# EAGLE design feuchte (EAGLE 6.6.0)
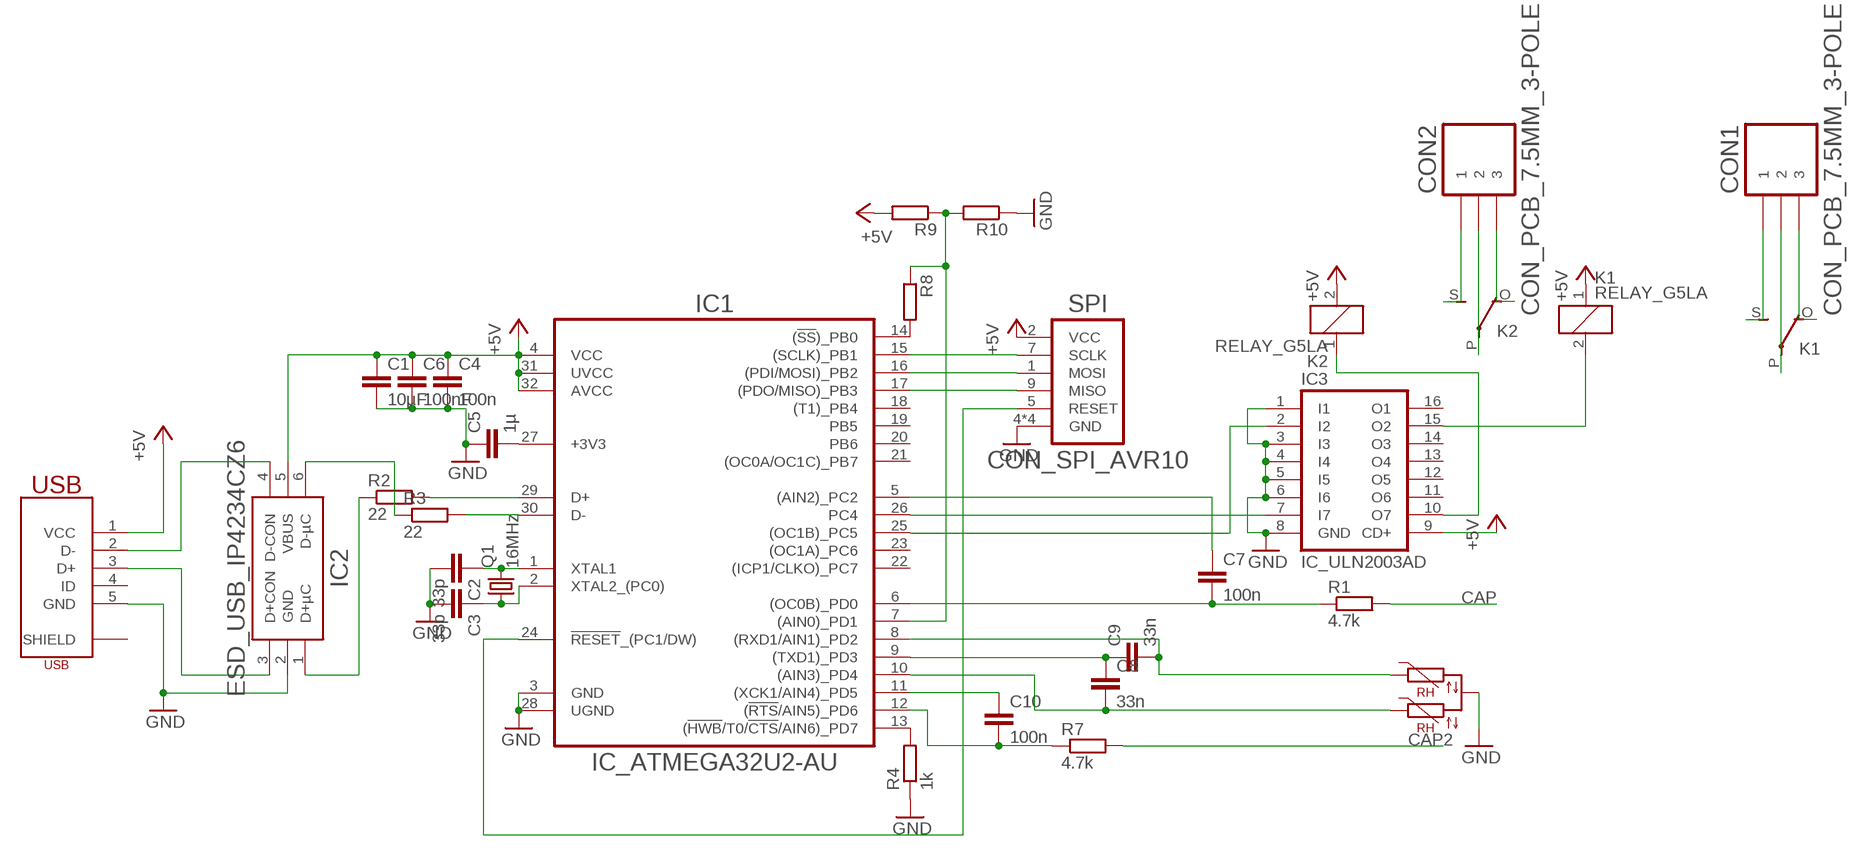
[diagram p0: schematic, sheet 1]

## Parts
C1  10µF  C  [0603]
C2  33p  C  [0603]
C3  33p  C  [0603]
C4  100n  C  [0603]
C5  1µ  C  [0603]
C6  100nF  C  [0603]
C7  100n  C  [0603]
C8  33n  C  [0603]
C9  33n  C  [0603]
C10  100n  C  [0603]
CON1  CON_PCB_7.5MM_3-POLE  [CON_PCB_7.5MM_3-POLE]
CON2  CON_PCB_7.5MM_3-POLE  [CON_PCB_7.5MM_3-POLE]
IC1  IC_ATMEGA32U2-AU  [IC_ATMEGA32U2-AU]
IC2  ESD_USB_IP4234CZ6  [ESD_USB_IP4234CZ6]
IC3  IC_ULN2003AD  [SOIC16]
K1  RELAY_G5LA  [RELAY_G5LA]
K2  RELAY_G5LA  [RELAY_G5LA]
Q1  16MHz  QUARTZ_HC49S  [QUARTZ_HC49S]
R1  4.7k  RSMD  [0603]
R2  22  RSMD  [0603]
R3  22  RSMD  [0603]
R4  1k  RSMD  [0603]
R7  4.7k  RSMD  [0603]
R8  RTHT_10MM  [R_THT_10MM]
R9  RTHT_7.5MM  [R_THT_7.5MM]
R10  RTHT_7.5MM  [R_THT_7.5MM]
SPI  CON_SPI_AVR10  [CON_ISP_AVR10]
U$2  SENS_SHS-A5  [SENS_SHS-A5]
USB  CON_MICROUSB_ZX62R-B-5P  [CON_MICROUSB_ZX62R-B-5P]

## Nets
+3V3: C5.2 IC1.27(+3V3)
+5V: C1.1 C4.1 C6.1 IC1.4(VCC) IC1.31(UVCC) IC1.32(AVCC) IC2.5(VBUS) IC3.9(CD+) K1.1 K2.2 R9.2 SPI.2(VCC) USB.1(VCC)
CAP: R1.2
CAP2: R7.2
GND: C1.2 C2.2 C3.2 C4.2 C5.1 C6.2 IC1.3(GND) IC1.28(UGND) IC2.2(GND) IC3.1(I1) IC3.3(I3) IC3.4(I4) IC3.5(I5) IC3.6(I6) IC3.8(GND) R4.1 R10.1 SPI.4(GND) SPI.6(GND) SPI.8(GND) SPI.10(GND) U$2.1 USB.5(GND)
N$1: C2.1 IC1.1(XTAL1) Q1.2
N$2: C3.1 IC1.2(XTAL2_(PC0)) Q1.1
N$3: IC1.15((SCLK)_PB1) SPI.7(SCLK)
N$4: IC1.16((PDI/MOSI)_PB2) SPI.1(MOSI)
N$5: IC1.17((PDO/MISO)_PB3) SPI.9(MISO)
N$6: IC1.24(!RESET!_(PC1/DW)) SPI.5(RESET)
N$7: CON2.2 K2.P
N$8: C7.1 IC1.5((AIN2)_PC2)
N$9: C7.2 IC1.6((OC0B)_PD0) R1.1
N$10: C10.1 IC1.11((XCK1/AIN4)_PD5)
N$11: IC1.26(PC4) IC3.7(I7)
N$12: IC1.25((OC1B)_PC5) IC3.2(I2)
N$13: IC3.10(O7) K2.1
N$14: IC3.15(O2) K1.2
N$15: CON2.1 K2.S
N$16: CON2.3 K2.O
N$17: CON1.1 K1.S
N$18: CON1.2 K1.P
N$19: CON1.3 K1.O
N$20: IC1.13((!HWB!/T0/!CTS!/AIN6)_PD7) R4.2
N$22: C9.2 IC1.8((RXD1/AIN1)_PD2) U$2.3
N$24: C8.1 C9.1 IC1.9((TXD1)_PD3)
N$25: C8.2 IC1.10((AIN3)_PD4) U$2.2
N$27: C10.2 IC1.12((!RTS!/AIN5)_PD6) R7.1
N$29: IC1.7((AIN0)_PD1) R8.1 R9.1 R10.2
N$30: IC1.14((!SS!)_PB0) R8.2
USBC_N: IC1.30(D-) R3.2
USBC_P: IC1.29(D+) R2.2
USBCON_N: IC2.4(D-CON) USB.2(D-)
USBCON_P: IC2.3(D+CON) USB.3(D+)
USBR_N: IC2.6(D-µC) R3.1
USBR_P: IC2.1(D+µC) R2.1
Unconnected: IC1.18((T1)_PB4) IC1.19(PB5) IC1.20(PB6) IC1.21((OC0A/OC1C)_PB7) IC1.22((ICP1/CLKO)_PC7) IC1.23((OC1A)_PC6) IC3.11(O6) IC3.12(O5) IC3.13(O4) IC3.14(O3) IC3.16(O1) USB.4(ID) USB.SHIELD1(SHIELD) USB.SHIELD2(SHIELD) USB.SHIELD3(SHIELD) USB.SHIELD4(SHIELD)

## Library data of the parts
C1-C10 = Bauelemente:C: Capacitor / Kondensator
CON1 CON2 = Bauelemente:CON_PCB_7.5MM_3-POLE
IC1 = Bauelemente:IC_ATMEGA32U2-AU: 8-bit Microcontroller with ISP Flash and USB Controller; MPN: ATMEGA32U2-AU; OC_FARNELL: 1748524; OC_NEWARK: 26R5632; PACKAGE: TQFP-32; SUPPLIER: Atmel
IC2 = Bauelemente:ESD_USB_IP4234CZ6: NXP IP4234CZ6 Single USB 2.0 ESD protection to IEC 61000-4-2 level 4
IC3 = Bauelemente:IC_ULN2003A: DRIVER ARRAY
K1 K2 = Bauelemente:RELAY_G5LA: Omron G5LA SPDT Relay
Q1 = Bauelemente:QUARTZ_HC49S
R1-R4 R7-R10 = Bauelemente:R: Resistor / Widerstand
SPI = Bauelemente:CON_SPI_AVR10
U$2 = Bauelemente:SENS_SHS-A5
USB = Bauelemente:CON_MICROUSB_ZX62R-B-5P

## Net classes
0 default: clearance 0.205 mm

## Board
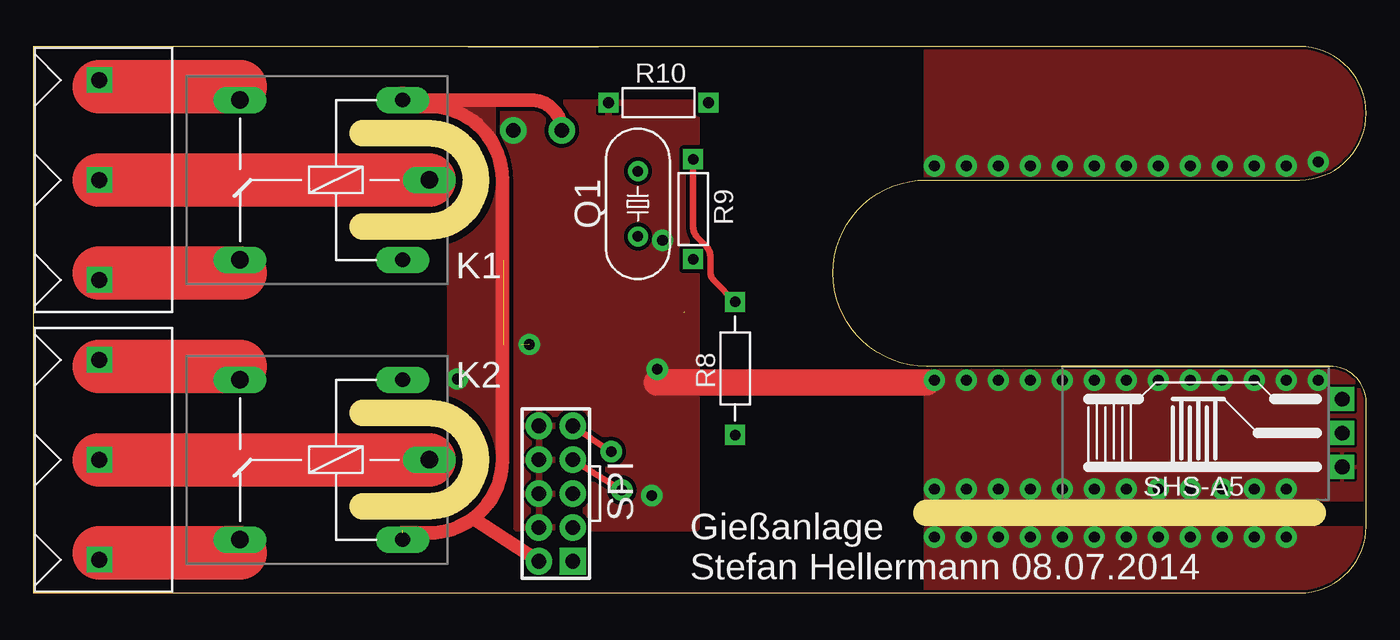
[diagram p1: board, top side]
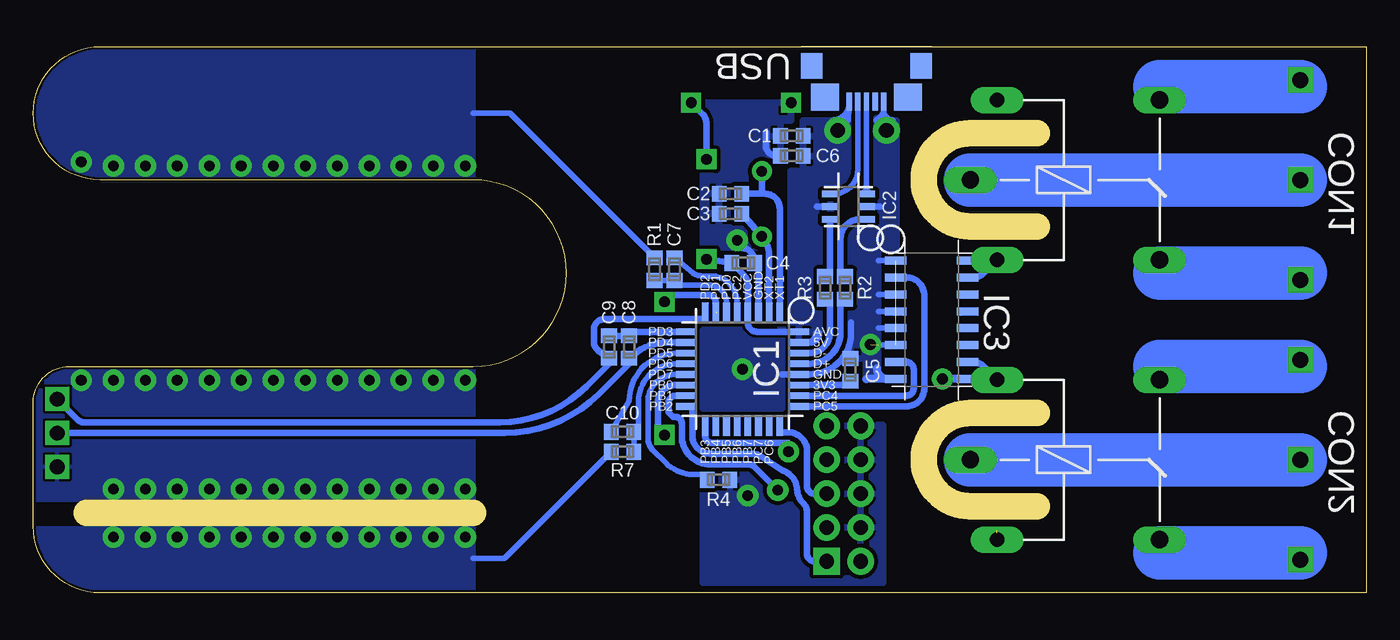
[diagram p2: board, bottom side, seen from below]

Size 100 x 41 mm. Coordinates in mm from the lower left corner, seen from the top.
Outline: 0,0 95,0 arc90 100,5 100,14.3 arc90 97.3,17 67,17 arc-90 60,24 arc-90 67,31 95,31 arc90 100,36 arc90 95,41 0,41 0,0
Copper layers (1*16): Top 0.035mm / dielectric 1.5mm / Bottom 0.035mm
Design rules "platinensammler_03 *": minimum track width 0.15mm, minimum drill 0.3mm, track to track 0.15mm, track to pad 0.15mm, pad to pad 0.15mm, via to via 0.15mm, smd to smd 0mil, copper to edge 0.2mm, drill to drill 0.2mm, minimum pad ring 0.35mm, minimum via ring 0.2mm, stop-mask expansion 2mil, vias tented up to drill 0.8mm, thermal gap 8mil
tRestrict: area 22,24 to 26.7,26; area 22,36 to 26.7,38; area 22,3 to 26.7,5; area 22,15 to 26.7,17; 2 lines
bRestrict: area 22,24 to 26.7,26; area 22,36 to 26.7,38; area 22,3 to 26.7,5; area 22,15 to 26.7,17; 2 lines
Milling: 7 lines

### Footprints (pad centres in the part's own frame; a part is rotated, then mirrored left to right if it is on the bottom)
0603 = smd 1.1 x 1.2: 1 -0.85,0; 2 0.85,0
CON_PCB_7.5MM_3-POLE = drill 1.2 square: 1 -7.5,0; 2 0,0; 3 7.5,0
IC_ATMEGA32U2-AU = smd 1.5 x 0.5: 1 -4.25,2.8; 2 -4.25,2; 3 -4.25,1.2; 4 -4.25,0.4; 5 -4.25,-0.4; 6 -4.25,-1.2; 7 -4.25,-2; 8 -4.25,-2.8; 17 4.25,-2.8; 18 4.25,-2; 19 4.25,-1.2; 20 4.25,-0.4; 21 4.25,0.4; 22 4.25,1.2; 23 4.25,2; 24 4.25,2.8 | smd 0.5 x 1.5: 9 -2.8,-4.25; 10 -2,-4.25; 11 -1.2,-4.25; 12 -0.4,-4.25; 13 0.4,-4.25; 14 1.2,-4.25; 15 2,-4.25; 16 2.8,-4.25; 25 2.8,4.25; 26 2,4.25; 27 1.2,4.25; 28 0.4,4.25; 29 -0.4,4.25; 30 -1.2,4.25; 31 -2,4.25; 32 -2.8,4.25
ESD_USB_IP4234CZ6 = smd 0.5 x 1.3: 1 -0.95,-1.35; 2 0,-1.35; 3 0.95,-1.35; 4 0.95,1.35; 5 0,1.35; 6 -0.95,1.35
SOIC16 = smd 0.6 x 1.6: 1 -4.445,-2.7; 2 -3.175,-2.7; 3 -1.905,-2.7; 4 -0.635,-2.7; 5 0.635,-2.7; 6 1.905,-2.7; 7 3.175,-2.7; 8 4.445,-2.7; 9 4.445,2.7; 10 3.175,2.7; 11 1.905,2.7; 12 0.635,2.7; 13 -0.635,2.7; 14 -1.905,2.7; 15 -3.175,2.7; 16 -4.445,2.7
RELAY_G5LA = drill 1.1 pad 2 long: 1 2,-6; 2 2,6 | drill 1.3 long: O 14.2,6; P 0,0; S 14.2,-6
QUARTZ_HC49S = drill 0.8: 1 -2.44,0; 2 2.44,0
R_THT_10MM = drill 0.8 square: 1 -5,0; 2 5,0
R_THT_7.5MM = drill 0.8 square: 1 -3.75,0; 2 3.75,0
CON_ISP_AVR10 = drill 1.1 pad 2 square: 1 -5.08,-1.27 | drill 1.1 pad 2: 2 -5.08,1.27; 3 -2.54,-1.27; 4 -2.54,1.27; 5 0,-1.27; 6 0,1.27; 7 2.54,-1.27; 8 2.54,1.27; 9 5.08,-1.27; 10 5.08,1.27
SENS_SHS-A5 = drill 1.1 square: 1 -2.54,0; 2 0,0; 3 2.54,0
CON_MICROUSB_ZX62R-B-5P = smd 0.4 x 1.35: 1 1.3,-0.675; 2 0.65,-0.675; 3 0,-0.675; 4 -0.65,-0.675; 5 -1.3,-0.675 | smd 2.1 x 2: SHIELD1 3.1,-1; SHIELD2 -3.1,-1 | smd 1.6 x 1.9: SHIELD3 -4.1,-3.35; SHIELD4 4.1,-3.35

### Placement (x,y rotation side)
C1  43.1,34.3 180 bottom
C2  47.7,29.95 180 bottom
C3  47.7,28.45 180 bottom
C4  46.75,24.75 0 bottom
C5  38.7,16.75 270 bottom
C6  43.1,32.8 180 bottom
C7  51.9,24.3 270 bottom
C8  55.3,18.45 270 bottom
C9  56.8,18.45 270 bottom
C10  55.8,12.1 0 bottom
CON1  4.95,31 270 top
CON2  4.95,10 270 top
IC1  46.8,16.8 270 bottom
IC2  38.85,29 90 bottom
IC3  32.6,20.5 270 bottom
K1  29.7,31 180 top
K2  29.7,10 180 top
Q1  45.35,29.2 90 top
R1  53.4,24.3 90 bottom
R2  39.1,22.9 270 bottom
R3  40.6,22.9 270 bottom
R4  48.6,8.5 180 bottom
R7  55.8,10.6 180 bottom
R8  52.65,16.85 270 top
R9  49.5,28.8 270 top
R10  46.9,36.8 0 top
SPI  39.2,7.45 90 top
U$2  98.2,12 90 top
USB  37.5,36.2 180 bottom

### Tracks (layer width: path | path; a pad name or v marks a point on that pad's centre or on a via)
+3V3
  Bottom 0.5: IC1.27 38.7,15.6 C5.2
+5V  (via drill 0.8, 1.1)  (1 unrouted)
  Top 0.4: 32.2,36.2 29.7,36.5 | 27.7,4.5 K2.2 | K1.1 27.7,36.5
  Top 0.6: 27.7,36.3 arc-270 28.4,37 | 27.7,4.7 arc270 28.4,4
  Top 1: 27.7,36.5 29.7,36.5 arc-90 35.2,31 35.2,10 arc-53 33,5.6 | 33,5.6 arc-37 29.7,4.5 27.7,4.5 | K1.1 37.35,37 arc-90 v39.65,34.7 | SPI.2 33,5.6
  Bottom 0.4: 39.4,35.5 39.09,35.81 38.85,35.5 38.8,36.4 38.8,36.7 | 38.8,36.7 arc90 40,35.5 | USB.1 38.8,36.7
  Bottom 0.5: 41.25,19.5 arc90 41.95,18.8 41.75,18.8 arc-90 41.05,19.5 | IC1.32 45.7,19.6 arc90 46.4,20.3 IC1.4 46.4,23.14 arc-45 46.69,23.84 C4.1 R9.2 | IC2.5 41.2,29
  Bottom 0.6: IC3.9 v31.8,16.05
  pour Bottom (isolate 0.3, rank 2): 38.1,36.75 39.5,35.45 42.25,35.45 42.25,31.65 43.2,31.65 43.2,19.8 44.1,19.8 arc90 43.1,18.7 39.8,18.7 39.8,30.2 38.2,30.5
  pour Top (isolate 0.3, rank 2): 35.3,31 35.3,10 31.25,10 31.25,31
  pour Top (isolate 0.3, rank 5): 27.7,37 34.5,37 34.5,33.7 31.2,36.8
CAP  (via drill 0.8)
  Bottom 0.4: R1.2 64.25,36 67,36
  other vias: 67.6,32.05 70,32.05 72.4,32.05 84.4,32.05 86.8,32.05 79.6,32.05 82,32.05 74.8,32.05 77.2,32.05 94,32.05 89.2,32.05 91.6,32.05 96.4,32.35
  pour Top: 67,31.2 99.8,31.2 99.8,40.8 67,40.8
  pour Bottom: 67,31.2 99.8,31.2 99.8,40.8 67,40.8
CAP2  (via drill 0.8)
  Bottom 0.4: R7.2 64.65,2.6 67,2.6
  other vias: 67.6,4.2 70,4.2 72.4,4.2 94,4.2 89.2,4.2 91.6,4.2 84.4,4.2 86.8,4.2 79.6,4.2 82,4.2 74.8,4.2 77.2,4.2
  pour Bottom: 67,4.8 99.8,4.8 99.8,0.2 67,0.2
  pour Top: 67,4.8 99.8,4.8 99.8,0.2 67,0.2
GND  (via drill 0.8, 1.1)  (5 unrouted)
  Top 1.975: 67,15.8 46.8,15.8
  Bottom 0.4: 36.2,36.2 36.2,35.4 | 36.2,36.31 arc45 36.35,35.85 36.8,35.5 | 36.2,36.2 arc-90 35.5,35.5 | 36.2,36.31 USB.5 | 36.2,36.31 36.2,36.2 | IC3.6 36.6,18.59 | IC3.5 36.6,19.87 | IC3.4 36.6,21.13 | IC3.3 36.6,22.41 | IC3.1 36.6,24.95
  Bottom 0.5: IC1.3 45.6,24.75 C4.2 45.9,24.9 arc-90 46.9,25.9 | IC2.2 36.5,29 | C6.2 44.25,32.8 arc90 45.05,33.6 45.05,34.6 | 38.65,20.3 38.65,19.5 arc90 41.75,16.4 IC1.28 43.85,16.4
  Bottom 0.6: 36.7,16.85 arc-90 35.9,16.05 IC3.8 37.5,16.05
  other vias: 36,34.7 47.2,26.45 37.2,18.65 46.4,7.3 46.8,16.8 67.6,7.8 70,7.8 72.4,7.8 84.4,7.8 86.8,7.8 79.6,7.8 82,7.8 74.8,7.8 77.2,7.8 94,7.8 89.2,7.8 91.6,7.8 67.6,15.95 70,15.95 72.4,15.95 84.4,15.95 86.8,15.95 79.6,15.95 82,15.95 74.8,15.95 77.2,15.95 94,15.95 89.2,15.95 91.6,15.95 96.4,15.95
  pour Bottom (isolate 0.3): 43.15,36.8 43.15,35.45 43.95,35.45 43.95,32.85 45.35,32.85 45.35,25.9 49.75,25.9 49.75,36.8
  pour Top (isolate 0.3, rank 4): 35.25,36.8 49.75,36.8 49.75,4.85 36.25,4.85 36.25,31 35.25,31
  pour Bottom (isolate 0.3): 35.25,35.45 35.25,25.8 36.65,25.8 36.65,16.05 37.55,16.05 37.55,17.6 38.65,17.6 38.65,27.25 36.75,27.25 36.75,35.65 36.2,35.65 36.2,35.45
  pour Bottom (isolate 0.3): 36.25,12.6 36.25,0.75 49.75,0.75 49.75,12.6
  pour Bottom: 43.85,13.85 49.75,13.85 49.75,19.75 43.85,19.75
  pour Top: 66.95,16.8 99.85,16.85 99.85,7 66.95,7
  pour Bottom: 66.95,16.8 99.85,16.85 99.85,7 66.95,7
N$1
  Bottom 0.5: IC1.1 44,28.85 arc-90 45.1,29.95 45.35,29.95 | Q1.2 45.35,29.95 | C2.1 45.35,29.95
N$2
  Bottom 0.5: IC1.2 44.8,25.43 arc-45 Q1.1 C3.1
N$3  (via drill 0.8)
  Top 0.5: SPI.7 v44.15,7.7
  Bottom 0.5: v44.15,7.7 45.94,9.49 arc-45 46.33,9.65 49.2,9.65 arc90 51.35,11.8 51.35,12.75 arc-90 51.8,13.2 arc90 52.35,13.75 52.35,14.25 arc90 51.8,14.8 IC1.15
N$4
  Bottom 0.5: IC1.16 50.55,14 50.55,11.8 arc-90 49.2,10.45 46.14,10.45 arc32 45.42,10.24 43.8,9.2 arc60 42.7,7.9 arc-45 42.27,6.77 42.24,6.74 arc45 41.95,6.04 41.95,2.92 arc-90 41.4,2.37 SPI.1
N$5  (via drill 0.8)
  Top 0.5: SPI.9 v43.35,10.6
  Bottom 0.5: v43.35,10.6 43.35,11.25 49.05,11.25 arc90 49.6,11.8 IC1.17
N$6
  Bottom 0.5: 44,13.05 IC1.24 44,12.05 43.35,12.05 arc90 41.95,10.65 41.95,8 arc-90 41.4,7.45 SPI.5
N$7
  Top 4: K2.P CON2.2
  Bottom 4: K2.P CON2.2
N$8
  Bottom 0.4: IC1.5 47.2,21.8 arc-90 49.2,23.8 49.89,23.8 arc39 50.52,24.02 C7.1
N$9
  Bottom 0.4: IC1.6 48,21.8 arc-90 49.3,23.1 51.89,23.1 C7.2 R1.1
N$10
  Bottom 0.4: IC1.11 51.7,18 arc-90 55.3,14.4 C10.1
N$11
  Bottom 0.5: IC1.26 34.5,14.8 arc-90 33.95,15.35 33.95,16.77 arc-90 34.5,17.33 IC3.7
N$12
  Bottom 0.5: IC1.25 34.5,14 arc-90 33.15,15.35 33.15,22.33 arc-90 34.5,23.67 IC3.2
N$13
  Bottom 0.5: IC3.10 29.44,17.33 arc45 28.73,17.03 K2.1
N$14
  Bottom 0.5: IC3.15 29.44,23.67 arc-45 28.73,23.97 K1.2
N$15
  Top 0.5: K2.S 15.5,17 | CON2.1 4.95,17
  Top 4: 15.5,17 4.95,17
  Bottom 0.5: K2.S 15.5,17 | CON2.1 4.95,17
  Bottom 4: 15.5,17 4.95,17
N$16
  Top 0.5: K2.O 15.5,3 | 4.95,3 CON2.3
  Top 4: 15.5,3 4.95,3
  Bottom 0.5: K2.O 15.5,3 | 4.95,3 CON2.3
  Bottom 4: 15.5,3 4.95,3
N$17
  Top 0.5: K1.S 15.5,38 | CON1.1 4.95,38
  Top 4: 15.5,38 4.95,38
  Bottom 0.5: K1.S 15.5,38 | CON1.1 4.95,38
  Bottom 4: 15.5,38 4.95,38
N$18
  Top 4: K1.P CON1.2
  Bottom 4: K1.P CON1.2
N$19
  Top 0.5: K1.O 15.5,24 | 4.95,24 CON1.3
  Top 4: 15.5,24 4.95,24
  Bottom 0.5: K1.O 15.5,24 | 4.95,24 CON1.3
  Bottom 4: 15.5,24 4.95,24
N$20
  Bottom 0.4: R4.2 49.2,8.9 50.5,8.9 arc45 52.55,9.75 53.53,10.73 arc45 53.9,11.62 53.9,14.3 arc90 51.8,16.4 IC1.13
N$22
  Bottom 0.5: IC1.8 49.6,20.55 57.15,20.55 arc-90 57.95,19.75 57.95,18.85 arc-54 57.63,18.21 C9.2 56.8,17.2 58.51,15.49 arc45 65.01,12.8 96.23,12.8 arc45 96.62,12.96 U$2.3
N$24
  Bottom 0.5: IC1.9 55.3,19.6 | 55.3,19.6 55.4,19.6 | C9.1 C8.1 55.3,19.6
N$25
  Bottom 0.5: IC1.10 52.4,18.8 arc-45 C8.2 55.3,17.2 57.57,14.93 arc45 64.64,12 U$2.2
N$27
  Bottom 0.4: IC1.12 51.75,17.2 arc-90 54.6,14.35 54.6,12.1 C10.2 R7.1
N$29  (1 unrouted)
  Top 0.5: R8.1 51.09,23.41 arc-45 50.8,24.11 50.8,25.16 arc45 50.42,26.08 49.88,26.62 arc-45 49.5,27.54 R9.1
  Bottom 0.5: 48.8,21.1 48.8,21.8 arc-90 49.35,22.35 52.65,22.35 R8.1 | R10.2 49.79,35.94 arc45 49.5,35.24 R9.1
N$30
  Bottom 0.5: IC1.14 51.8,15.6 arc-90 53.15,14.25 53.15,12.89 arc-45 52.77,11.97 R8.2
USBC_N
  Bottom 0.5: R3.2 40.25,22.05 40.25,19.5 arc90 41.75,18 IC1.30
USBC_P
  Bottom 0.5: R2.2 39.45,22.05 39.45,19.5 arc90 41.75,17.2 IC1.29
USBCON_N
  Bottom 0.4: USB.2 38.15,31.75 arc90 39.95,29.95 IC2.4
USBCON_P
  Bottom 0.4: USB.3 37.5,30.4 | 37.5,30.4 IC2.3 | 37.5,30.4 arc90 37.9,30 | 37.5,30.4 arc-90 37.1,30
USBR_N
  Bottom 0.5: R3.1 40.25,23.75 40.25,28 40.2,28 IC2.6
USBR_P
  Bottom 0.5: R2.1 39.45,23.75 39.45,26.55 arc90 37.95,28.05 IC2.1

### Text on the board
tPlace: Gießanlage / Stefan Hellermann 08.07.2014